# EAGLE design schematic hovedboks (EAGLE 9.6.2)
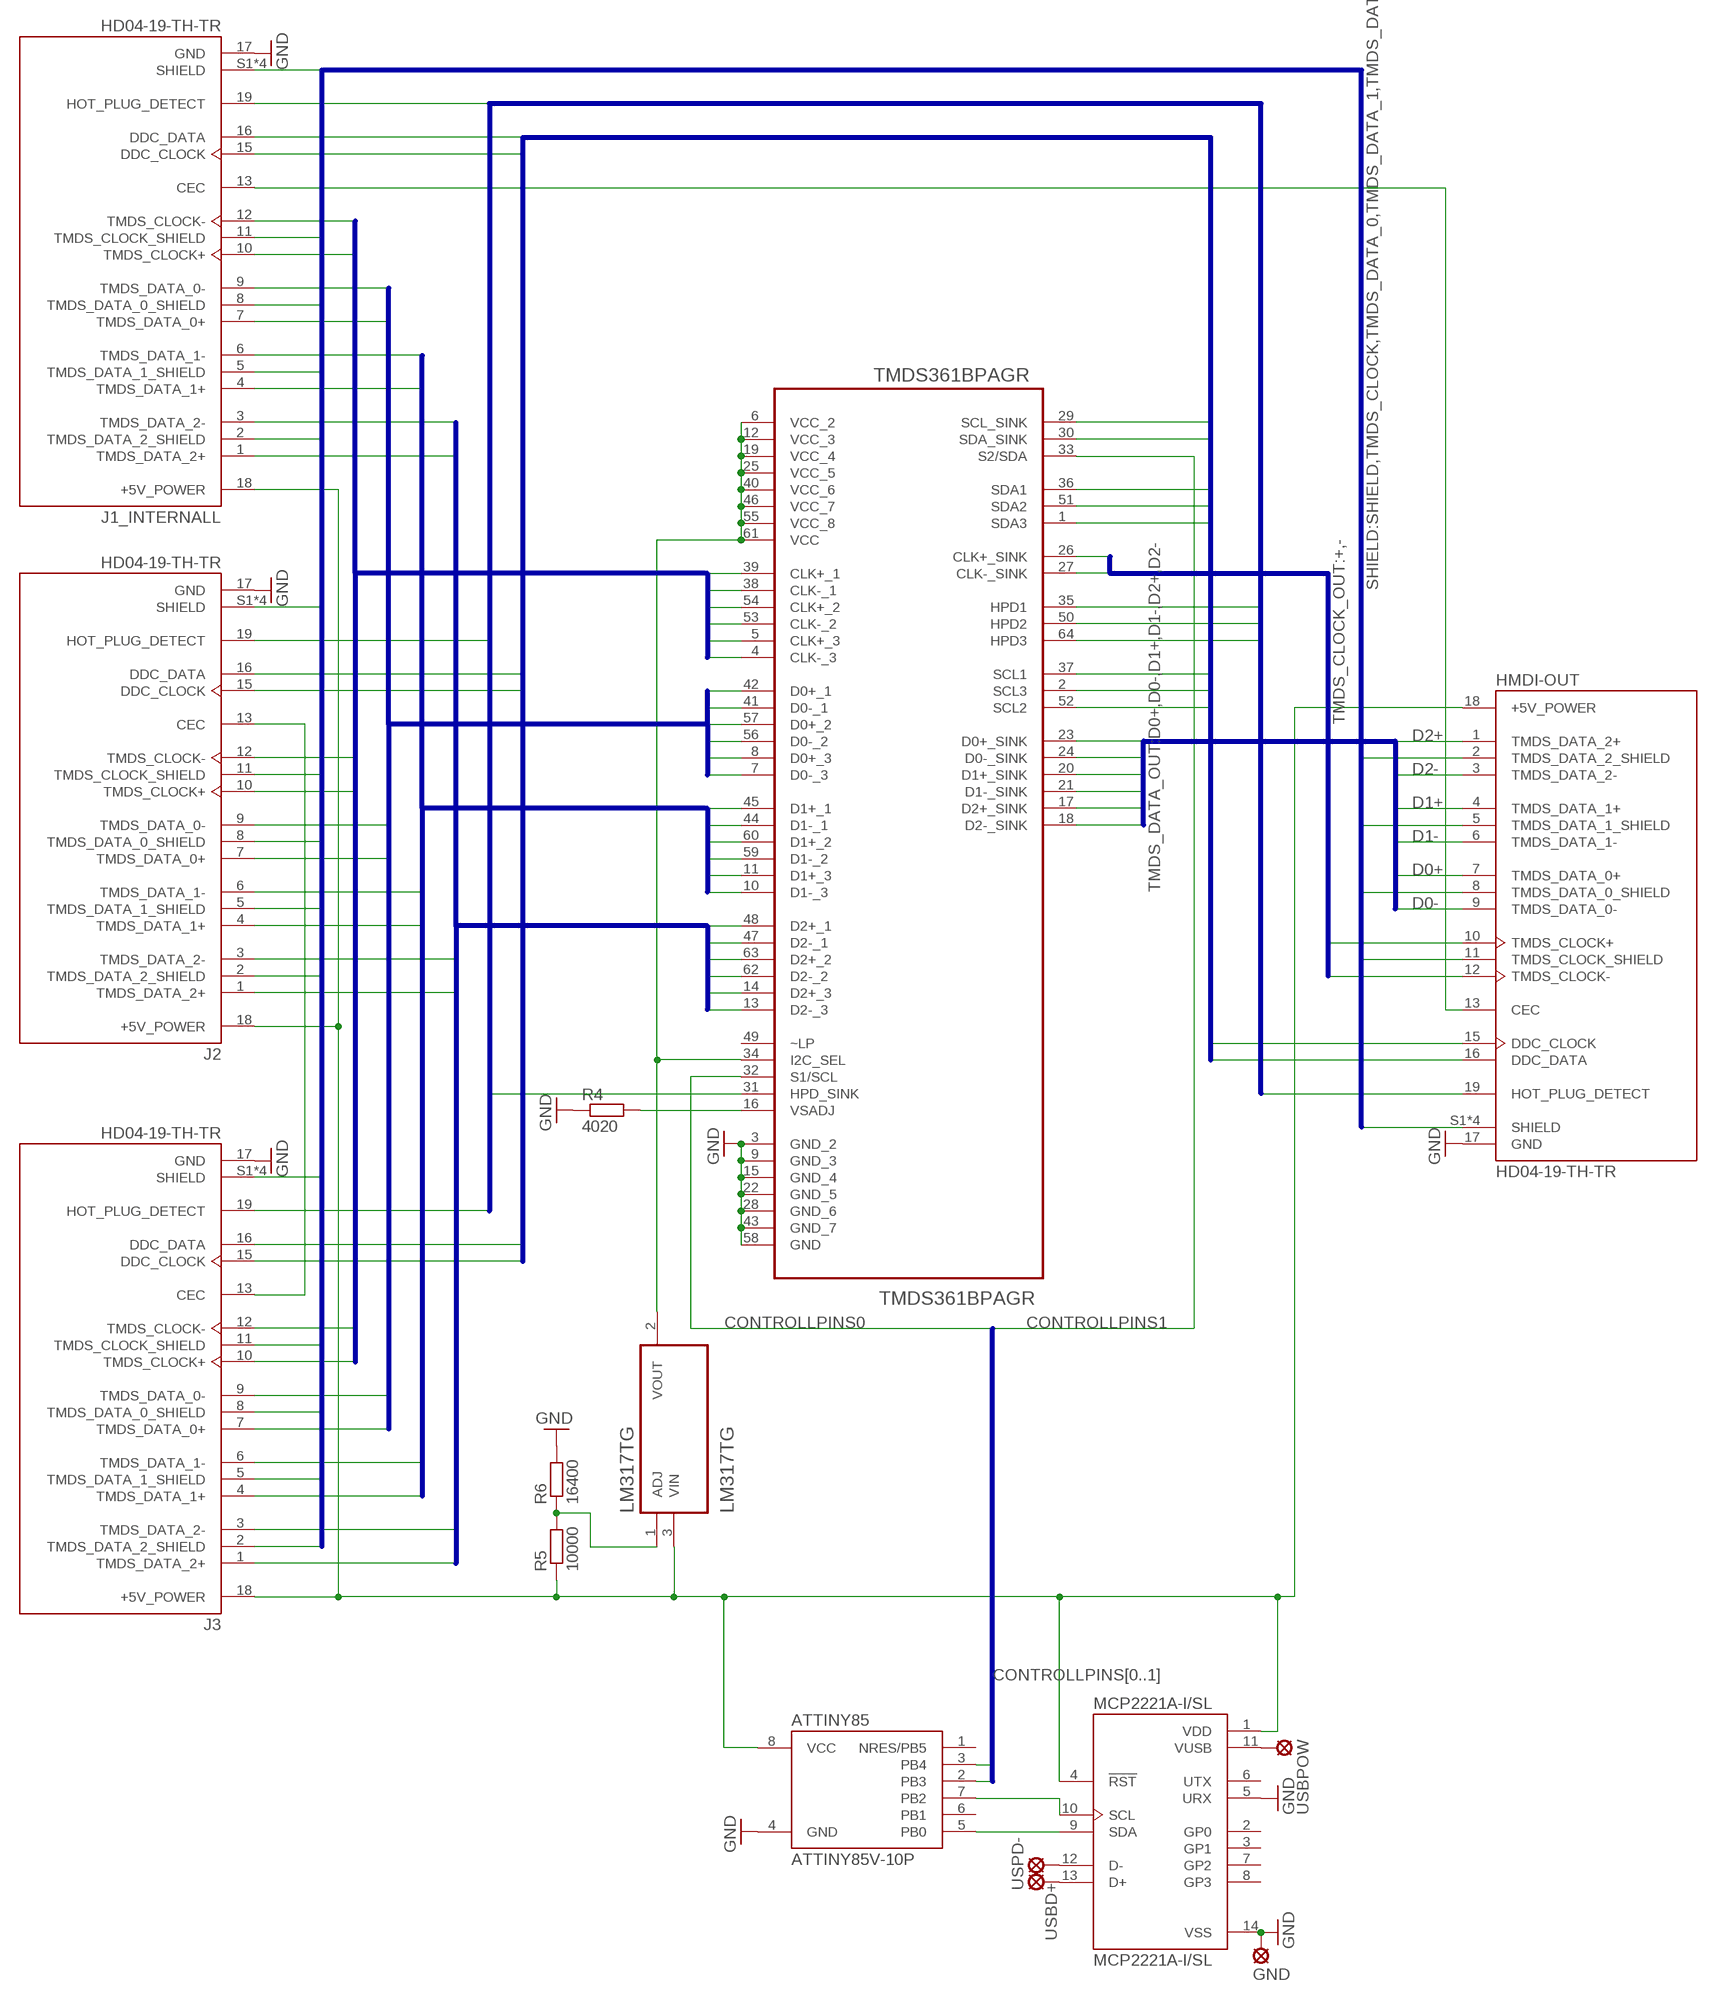
[diagram p0: schematic, sheet 1]

## Parts
ATTINY85  ATTINY85V-10P  [PDIP08_300MIL]
GND  LSP10  [LSP10]
HMDI-OUT  HD04-19-TH-TR  [CUI_HD04-19-TH-TR]
J1_INTERNALL  HD04-19-TH-TR  [CUI_HD04-19-TH-TR]
J2  HD04-19-TH-TR  [CUI_HD04-19-TH-TR]
J3  HD04-19-TH-TR  [CUI_HD04-19-TH-TR]
LM317TG  LM317TG  [TO254P1054X470X1955-3]
MCP2221A-I/SL  MCP2221A-I/SL  [SOIC127P600X175-14N]
R4  4020  R-EU_0204/7  [0204/7]
R5  10000  R-EU_0204/7  [0204/7]
R6  16400  R-EU_0204/7  [0204/7]
TMDS361BPAGR  TMDS361BPAGR  [QFP50P1200X1200X120-64N]
USBD+  LSP10  [LSP10]
USBPOW  LSP10  [LSP10]
USPD-  LSP10  [LSP10]

## Nets
1: J1_INTERNALL.19(HOT_PLUG_DETECT) TMDS361BPAGR.35(HPD1)
1_CLOCK: J1_INTERNALL.15(DDC_CLOCK) TMDS361BPAGR.37(SCL1)
1_DATA: J1_INTERNALL.16(DDC_DATA) TMDS361BPAGR.36(SDA1)
2: J2.19(HOT_PLUG_DETECT) TMDS361BPAGR.50(HPD2)
2_CLOCK: J2.15(DDC_CLOCK) TMDS361BPAGR.2(SCL3)
2_DATA: J2.16(DDC_DATA) TMDS361BPAGR.51(SDA2)
3: J3.19(HOT_PLUG_DETECT) TMDS361BPAGR.64(HPD3)
3_CLOCK: J3.15(DDC_CLOCK) TMDS361BPAGR.52(SCL2)
3_DATA: J3.16(DDC_DATA) TMDS361BPAGR.1(SDA3)
5V: ATTINY85.8(VCC) HMDI-OUT.18(+5V_POWER) J1_INTERNALL.18(+5V_POWER) J2.18(+5V_POWER) J3.18(+5V_POWER) LM317TG.3(VIN) MCP2221A-I/SL.1(VDD) MCP2221A-I/SL.4(!RST) R5.1
+: HMDI-OUT.10(TMDS_CLOCK+) TMDS361BPAGR.26(CLK+_SINK)
+1: J1_INTERNALL.1(TMDS_DATA_2+) J1_INTERNALL.4(TMDS_DATA_1+) J1_INTERNALL.7(TMDS_DATA_0+) J1_INTERNALL.10(TMDS_CLOCK+) J3.10(TMDS_CLOCK+) TMDS361BPAGR.39(CLK+_1) TMDS361BPAGR.42(D0+_1) TMDS361BPAGR.45(D1+_1) TMDS361BPAGR.48(D2+_1)
+2: J2.1(TMDS_DATA_2+) J2.4(TMDS_DATA_1+) J2.7(TMDS_DATA_0+) J2.10(TMDS_CLOCK+) TMDS361BPAGR.54(CLK+_2) TMDS361BPAGR.57(D0+_2) TMDS361BPAGR.60(D1+_2) TMDS361BPAGR.63(D2+_2)
+3: J3.1(TMDS_DATA_2+) J3.4(TMDS_DATA_1+) J3.7(TMDS_DATA_0+) TMDS361BPAGR.5(CLK+_3) TMDS361BPAGR.8(D0+_3) TMDS361BPAGR.11(D1+_3) TMDS361BPAGR.14(D2+_3)
-: HMDI-OUT.12(TMDS_CLOCK-) TMDS361BPAGR.27(CLK-_SINK)
-1: J1_INTERNALL.3(TMDS_DATA_2-) J1_INTERNALL.6(TMDS_DATA_1-) J1_INTERNALL.9(TMDS_DATA_0-) J1_INTERNALL.12(TMDS_CLOCK-) J3.12(TMDS_CLOCK-) TMDS361BPAGR.38(CLK-_1) TMDS361BPAGR.41(D0-_1) TMDS361BPAGR.44(D1-_1) TMDS361BPAGR.47(D2-_1)
-2: J2.3(TMDS_DATA_2-) J2.6(TMDS_DATA_1-) J2.9(TMDS_DATA_0-) J2.12(TMDS_CLOCK-) TMDS361BPAGR.53(CLK-_2) TMDS361BPAGR.56(D0-_2) TMDS361BPAGR.59(D1-_2) TMDS361BPAGR.62(D2-_2)
-3: J3.3(TMDS_DATA_2-) J3.6(TMDS_DATA_1-) J3.9(TMDS_DATA_0-) TMDS361BPAGR.4(CLK-_3) TMDS361BPAGR.7(D0-_3) TMDS361BPAGR.10(D1-_3) TMDS361BPAGR.13(D2-_3)
CEC_INTERNAL-OUT: HMDI-OUT.13(CEC) J1_INTERNALL.13(CEC)
CONTROLLPINS0: ATTINY85.2(PB3) TMDS361BPAGR.32(S1/SCL)
CONTROLLPINS1: ATTINY85.3(PB4) TMDS361BPAGR.33(S2/SDA)
D0+: HMDI-OUT.7(TMDS_DATA_0+) TMDS361BPAGR.23(D0+_SINK)
D0-: HMDI-OUT.9(TMDS_DATA_0-) TMDS361BPAGR.24(D0-_SINK)
D1+: HMDI-OUT.4(TMDS_DATA_1+) TMDS361BPAGR.20(D1+_SINK)
D1-: HMDI-OUT.6(TMDS_DATA_1-) TMDS361BPAGR.21(D1-_SINK)
D2+: HMDI-OUT.1(TMDS_DATA_2+) TMDS361BPAGR.17(D2+_SINK)
D2-: HMDI-OUT.3(TMDS_DATA_2-) TMDS361BPAGR.18(D2-_SINK)
GND: ATTINY85.4(GND) GND.MP HMDI-OUT.17(GND) J1_INTERNALL.17(GND) J2.17(GND) J3.17(GND) MCP2221A-I/SL.5(URX) MCP2221A-I/SL.14(VSS) R4.1 R6.2 TMDS361BPAGR.3(GND_2) TMDS361BPAGR.9(GND_3) TMDS361BPAGR.15(GND_4) TMDS361BPAGR.22(GND_5) TMDS361BPAGR.28(GND_6) TMDS361BPAGR.43(GND_7) TMDS361BPAGR.58(GND)
N$1: J2.13(CEC) J3.13(CEC)
N$3: LM317TG.2(VOUT) TMDS361BPAGR.6(VCC_2) TMDS361BPAGR.12(VCC_3) TMDS361BPAGR.19(VCC_4) TMDS361BPAGR.25(VCC_5) TMDS361BPAGR.34(I2C_SEL) TMDS361BPAGR.40(VCC_6) TMDS361BPAGR.46(VCC_7) TMDS361BPAGR.55(VCC_8) TMDS361BPAGR.61(VCC)
N$4: LM317TG.1(ADJ) R5.2 R6.1
N$5: ATTINY85.5(PB0) MCP2221A-I/SL.9(SDA)
N$6: ATTINY85.7(PB2) MCP2221A-I/SL.10(SCL)
N$7: MCP2221A-I/SL.11(VUSB) USBPOW.MP
N$8: MCP2221A-I/SL.13(D+) USBD+.MP
N$9: MCP2221A-I/SL.12(D-) USPD-.MP
N$10: R4.2 TMDS361BPAGR.16(VSADJ)
OUT: HMDI-OUT.19(HOT_PLUG_DETECT) TMDS361BPAGR.31(HPD_SINK)
OUT_CLOCK: HMDI-OUT.15(DDC_CLOCK) TMDS361BPAGR.29(SCL_SINK)
OUT_DATA: HMDI-OUT.16(DDC_DATA) TMDS361BPAGR.30(SDA_SINK)
SHIELD: HMDI-OUT.S1(SHIELD) HMDI-OUT.S2(SHIELD) HMDI-OUT.S3(SHIELD) HMDI-OUT.S4(SHIELD) J1_INTERNALL.S1(SHIELD) J1_INTERNALL.S2(SHIELD) J1_INTERNALL.S3(SHIELD) J1_INTERNALL.S4(SHIELD) J2.S1(SHIELD) J2.S2(SHIELD) J2.S3(SHIELD) J2.S4(SHIELD) J3.S1(SHIELD) J3.S2(SHIELD) J3.S3(SHIELD) J3.S4(SHIELD)
TMDS_CLOCK: HMDI-OUT.11(TMDS_CLOCK_SHIELD) J1_INTERNALL.11(TMDS_CLOCK_SHIELD) J2.11(TMDS_CLOCK_SHIELD) J3.11(TMDS_CLOCK_SHIELD)
TMDS_DATA_0: HMDI-OUT.8(TMDS_DATA_0_SHIELD) J1_INTERNALL.8(TMDS_DATA_0_SHIELD) J2.8(TMDS_DATA_0_SHIELD) J3.8(TMDS_DATA_0_SHIELD)
TMDS_DATA_1: HMDI-OUT.5(TMDS_DATA_1_SHIELD) J1_INTERNALL.5(TMDS_DATA_1_SHIELD) J2.5(TMDS_DATA_1_SHIELD) J3.5(TMDS_DATA_1_SHIELD)
TMDS_DATA_2: HMDI-OUT.2(TMDS_DATA_2_SHIELD) J1_INTERNALL.2(TMDS_DATA_2_SHIELD) J2.2(TMDS_DATA_2_SHIELD) J3.2(TMDS_DATA_2_SHIELD)
Unconnected: ATTINY85.1(NRES/PB5) ATTINY85.6(PB1) MCP2221A-I/SL.2(GP0) MCP2221A-I/SL.3(GP1) MCP2221A-I/SL.6(UTX) MCP2221A-I/SL.7(GP2) MCP2221A-I/SL.8(GP3) TMDS361BPAGR.49(~LP)

## Buses
TMDS_DATA_OUT:D0+,D0-,D1+,D1-,D2+,D2-
SHIELD:SHIELD,TMDS_CLOCK,TMDS_DATA_0,TMDS_DATA_1,TMDS_DATA_2
TMDS_CLOCK_OUT:+,-
TDMS_CLOCK_IN:+1,-1,+2,-2,+3,-3
TDMS_DATA_0_IN:+1,-1,+2,-2,+3,-3
TDMS_DATA_1_IN:+1,-1,+2,-2,+3,-3
TDMS_DATA_2_IN:+1,-1,+2,-2,+3,-3
HPD:1,2,3,OUT
DDC:1_CLOCK,1_DATA,2_CLOCK,2_DATA,3_CLOCK,3_DATA,OUT_CLOCK,OUT_DATA
CONTROLLPINS[0..1]

## Library data of the parts
ATTINY85 = _hhn_attiny25_45_85:ATTINY85*: ATMEL ATtiny 85 Packages: P = PDIP 08 30mil S = SOIC 08 EIAJ 208mil Technologies Note: for complete ordering code (temp. range, finish, tape&reel etc.) see www.atmel.com • Supply Voltage: V = (1.8…5.5)V | [blank] = (2.7…5.5)V • Speed: 10 = 10 MHz | 20 = 20 MHz Author: Dipl.-Ing. FH Rainer Bayer HHN Hochschule Heilbronn (Heilbronn University), rainer.bayer@hs-heilbronn.de Ingenieurbüro ing-rb, mail@ing-rb.de
GND USBD+ USBPOW USPD- = solpad:LSP10: SOLDER PAD drill 1.0 mm, distributor Buerklin, 12H555
HMDI-OUT J1_INTERNALL J2 J3 = HD04-19-TH-TR:HD04-19-TH-TR: HDMI RECEPTACLE; MANUFACTURER: CUI Devices; MAXIMUM_PACKAGE_HEIGHT: 6.27mm; PARTREV: 1.0; STANDARD: Manufacturer Recommendations
LM317TG = LM317TG:LM317TG: Check prices <https://pricing.snapeda.com/parts/LM317TG/ON%20Semiconductor/view-part?ref=eda>; AVAILABILITY: In Stock; DESCRIPTION: Linear Voltage Regulator IC Positive Adjustable 1 Output 1.5A TO-220-3; MF: ON Semiconductor; MP: LM317TG; PACKAGE: TO-220-3 ON Semiconductor; PRICE: None; PURCHASE-URL: https://pricing.snapeda.com/search/part/LM317TG/?ref=eda
MCP2221A-I/SL = MCP2221A-I_SL:MCP2221A-I/SL: USB 2.0-to-I2C/UART/SMBus Protocol Converter with GPIO (Master Mode) Check availability <https://pricing.snapeda.com/parts/MCP2221A-I/SL/Microchip/view-part?ref=eda>; AVAILABILITY: In Stock; DESCRIPTION: USB Bridge, USB to I²C/UART USB 2.0 I²C, UART Interface 14-SOIC; MF: Microchip; MP: MCP2221A-I/SL; PACKAGE: SO-14 Microchip; PRICE: None; PURCHASE-URL: https://pricing.snapeda.com/search/part/MCP2221A-I/SL/?ref=eda
R4-R6 = rcl:R-EU_: RESISTOR, European symbol; SPICEPREFIX: R
TMDS361BPAGR = Texas Instruments_By_element14_Batch_1:TMDS361BPAGR: Three-Port HDMI Switch; MPN: TMDS361BPAGR; OC_FARNELL: -; OC_NEWARK: 55R7479; PACKAGE: TQFP-64; SUPPLIER: Texas Instruments

## Board
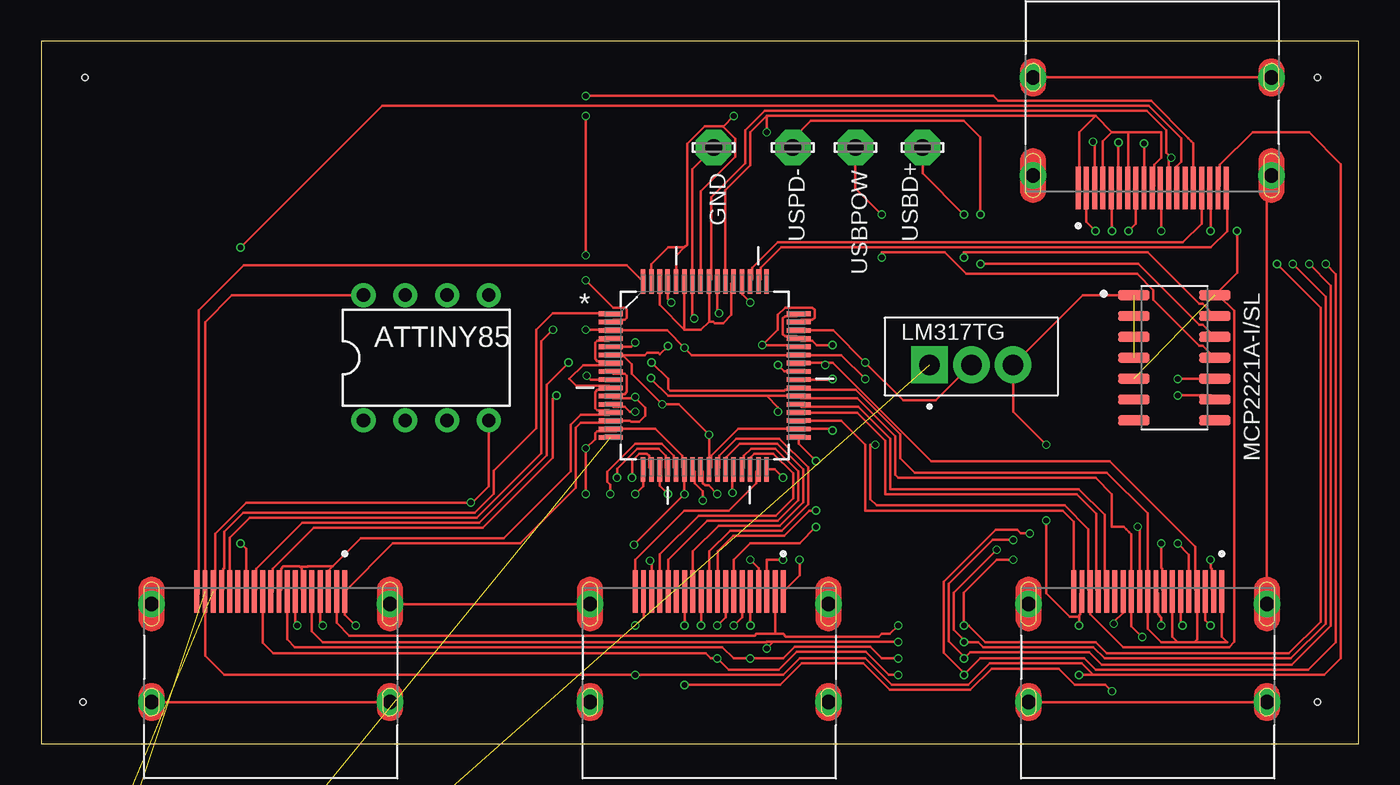
[diagram p1: board, top side]
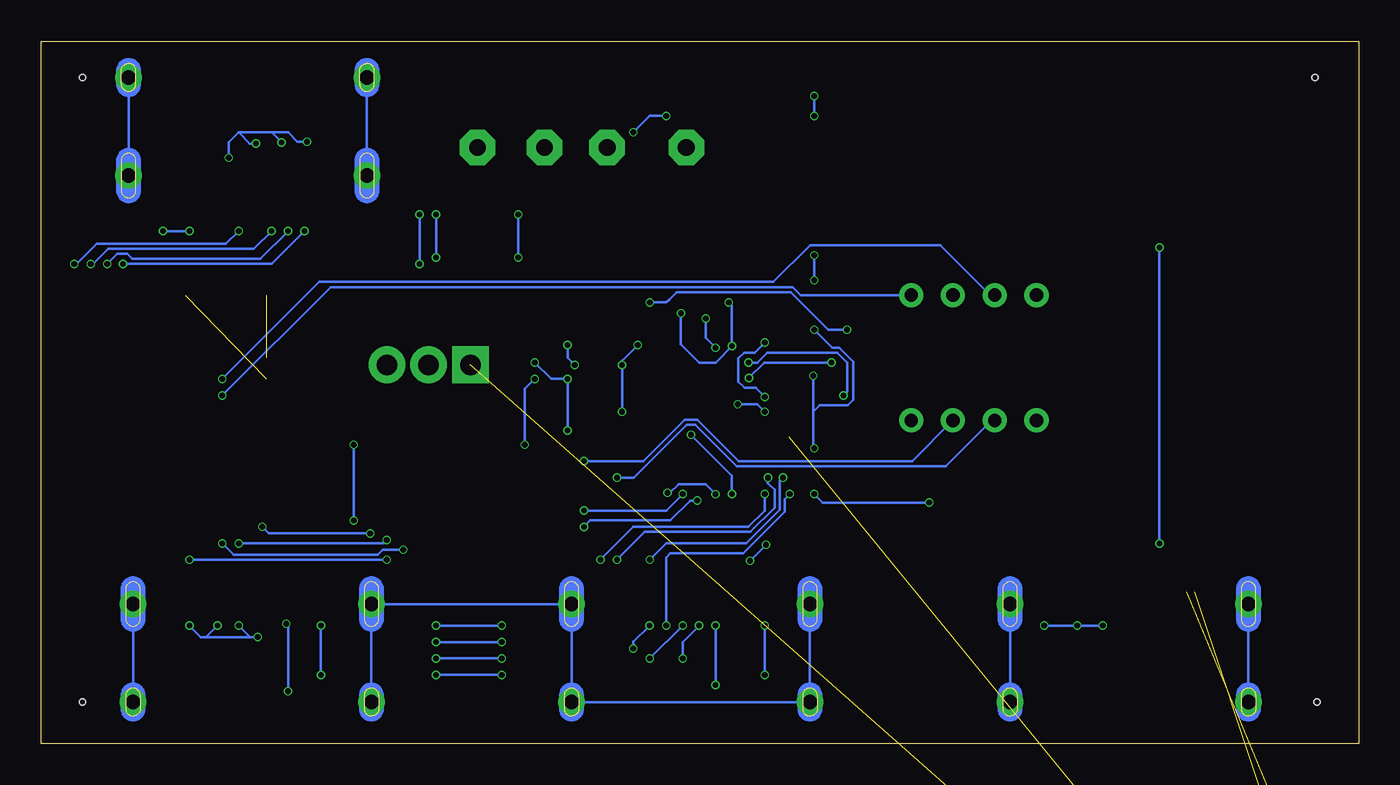
[diagram p2: board, bottom side, seen from below]

Size 80.15 x 42.74 mm. Coordinates in mm from the lower left corner, seen from the top.
Outline: 0,0 80.15,0 80.15,42.74 0,42.74 0,0
Copper layers (1*16): Top 0.035mm / dielectric 1.6mm / Bottom 0.035mm
Design rules "jlcpcb-2layers": minimum track width 5mil, minimum drill 0.3mm, track to track 5mil, track to pad 5mil, pad to pad 5mil, via to via 5mil, smd to smd 5mil, copper to edge 0.2mm, drill to drill 6mil, minimum pad ring 10mil, minimum via ring 3mil, stop-mask expansion 4mil, vias tented up to drill 0mil, thermal gap 10mil
Holes 0.35 mm at 2.67,40.53 2.54,2.54 77.63,40.53 77.63,2.54

### Footprints (pad centres in the part's own frame; a part is rotated, then mirrored left to right if it is on the bottom)
PDIP08_300MIL = drill 0.813: 1 -3.81,-3.81; 2 -1.27,-3.81; 3 1.27,-3.81; 4 3.81,-3.81; 5 3.81,3.81; 6 1.27,3.81; 7 -1.27,3.81; 8 -3.81,3.81
LSP10 = drill 1.016 pad 2.159 octagon: MP 0,0
CUI_HD04-19-TH-TR = smd 0.3 x 2.6: 1 4.5,6.72; 2 4,6.72; 3 3.5,6.72; 4 3,6.72; 5 2.5,6.72; 6 2,6.72; 7 1.5,6.72; 8 1,6.72; 9 0.5,6.72; 10 0,6.72; 11 -0.5,6.72; 12 -1,6.72; 13 -1.5,6.72; 14 -2,6.72; 15 -2.5,6.72; 16 -3,6.72; 17 -3.5,6.72; 18 -4,6.72; 19 -4.5,6.72 | drill 0.9 pad 1.5: S1 -7.25,5.96; S2 7.25,5.96; S3 -7.25,0; S4 7.25,0
TO254P1054X470X1955-3 = drill 1.24 square: 1 -2.54,0 | drill 1.24: 2 0,0; 3 2.54,0
SOIC127P600X175-14N = smd 1.91 x 0.6: 1 -2.46,3.81; 2 -2.46,2.54; 3 -2.46,1.27; 4 -2.46,0; 5 -2.46,-1.27; 6 -2.46,-2.54; 7 -2.46,-3.81; 8 2.46,-3.81; 9 2.46,-2.54; 10 2.46,-1.27; 11 2.46,0; 12 2.46,1.27; 13 2.46,2.54; 14 2.46,3.81
0204/7 = drill 0.813 octagon: 1 -3.81,0; 2 3.81,0
QFP50P1200X1200X120-64N = smd 1.473 x 0.279: 1 -5.715,3.759; 2 -5.715,3.251; 3 -5.715,2.743; 4 -5.715,2.261; 5 -5.715,1.753; 6 -5.715,1.245; 7 -5.715,0.762; 8 -5.715,0.254; 9 -5.715,-0.254; 10 -5.715,-0.762; 11 -5.715,-1.245; 12 -5.715,-1.753; 13 -5.715,-2.261; 14 -5.715,-2.743; 15 -5.715,-3.251; 16 -5.715,-3.759; 33 5.715,-3.759; 34 5.715,-3.251; 35 5.715,-2.743; 36 5.715,-2.261; 37 5.715,-1.753; 38 5.715,-1.245; 39 5.715,-0.762; 40 5.715,-0.254; 41 5.715,0.254; 42 5.715,0.762; 43 5.715,1.245; 44 5.715,1.753; 45 5.715,2.261; 46 5.715,2.743; 47 5.715,3.251; 48 5.715,3.759 | smd 0.279 x 1.473: 17 -3.759,-5.715; 18 -3.251,-5.715; 19 -2.743,-5.715; 20 -2.261,-5.715; 21 -1.753,-5.715; 22 -1.245,-5.715; 23 -0.762,-5.715; 24 -0.254,-5.715; 25 0.254,-5.715; 26 0.762,-5.715; 27 1.245,-5.715; 28 1.753,-5.715; 29 2.261,-5.715; 30 2.743,-5.715; 31 3.251,-5.715; 32 3.759,-5.715; 49 3.759,5.715; 50 3.251,5.715; 51 2.743,5.715; 52 2.261,5.715; 53 1.753,5.715; 54 1.245,5.715; 55 0.762,5.715; 56 0.254,5.715; 57 -0.254,5.715; 58 -0.762,5.715; 59 -1.245,5.715; 60 -1.753,5.715; 61 -2.261,5.715; 62 -2.743,5.715; 63 -3.251,5.715; 64 -3.759,5.715

### Placement (x,y rotation side)
ATTINY85  23.42,23.48 0 top
GND  40.91,36.26 0 top
HMDI-OUT  40.64,2.54 0 top
J1_INTERNALL  67.31,2.54 0 top
J2  67.58,40.53 180 top
J3  13.97,2.54 0 top
LM317TG  56.58,23.05 0 top
MCP2221A-I/SL  68.93,23.48 0 top
R4  5.13,-12.81 0 top  (outside the outline)
R5  5.13,-16.81 0 top  (outside the outline)
R6  5.13,-20.81 0 top  (outside the outline)
TMDS361BPAGR  40.37,22.4 0 top
USBD+  53.61,36.26 0 top
USBPOW  49.53,36.26 0 top
USPD-  45.72,36.26 0 top

### Tracks (layer width: path | path; a pad name or v marks a point on that pad's centre or on a via)
1
  Top 0.152: J1_INTERNALL.19 62.81,13.51 62.13,14.19 50.13,14.19 50.13,18.19 48.66,19.66 TMDS361BPAGR.35
1_CLOCK
  Top 0.152: J1_INTERNALL.15 64.69,9.38 64.69,13.92 63.12,15.49 51.65,15.49 51.65,18.57 49.71,20.51 46.22,20.51 TMDS361BPAGR.37
1_DATA
  Top 0.152: J1_INTERNALL.16 64.19,9.38 64.19,13.99 62.99,15.19 51.34,15.19 51.34,18.44 49.65,20.14 TMDS361BPAGR.36
2
  Top 0.152: TMDS361BPAGR.50 43.76,28.25 43.76,28.95 45,30.19 71.13,30.19 72.13,31.19 72.13,33.76 J2.19
2_CLOCK  (via drill 0.35)
  Top 0.152: v33.13,38.19 v33.13,29.72 | TMDS361BPAGR.2 34.8,25.79 35.49,25.79 35.62,25.93 35.62,26.39 35.49,26.53 34.79,26.53 v33.13,28.19 | v33.13,39.41 57.91,39.41 58.22,39.1 67.51,39.1 69.78,36.84 69.96,36.66 70.08,36.53 J2.15
  Bottom 0.152: v33.13,39.41 v33.13,38.19 | v33.13,29.72 v33.13,28.19
2_DATA
  Top 0.152: TMDS361BPAGR.51 43.25,28.25 43.25,28.95 44.8,30.5 69.44,30.5 70.58,31.64 J2.16
3
  Top 0.152: J3.19 9.59,9.14 9.59,26.37 12.34,29.11 35.61,29.11 TMDS361BPAGR.64
3_CLOCK  (via drill 0.35)
  Top 0.152: J3.15 11.47,12.53 12.7,13.76 26.51,13.76 30.43,17.69 30.43,24.5 v31.13,25.19 | v43.13,26.85 42.63,27.35 TMDS361BPAGR.52
  Bottom 0.152: v31.13,25.19 32.27,25.19 34.56,27.48 41.48,27.48 41.95,27.01 42.11,26.85 v43.13,26.85
3_DATA
  Top 0.152: J3.16 11.09,9.38 11.09,10.65 11.13,10.69 11.13,12.9 12.3,14.06 26.38,14.06 27.54,15.22 27.54,16.6 30.13,19.19 30.13,25.19 31.13,26.19 34.62,26.19 TMDS361BPAGR.1
5V  (via drill 0.35)  (2 unrouted)
  Top 0.152: ATTINY85.8 11.61,27.29 9.97,25.65 J3.18 9.97,5.35 11.13,4.19 v36.13,4.19 45.13,4.19 46.13,5.19 50.13,5.19 51.74,3.58 56.38,3.58 57.68,4.88 63.31,4.88 64,4.19 | 63.13,7.81 63.05,7.73 62.56,7.73 61.13,9.17 v61.13,13.58 | v61.13,18.19 59.12,20.2 LM317TG.3 63.36,27.29 MCP2221A-I/SL.1 | J2.18 71.7,33.93 71.7,35.2 73.69,37.19 77.13,37.19 79.06,35.26 79.06,5.19 78.06,4.19 64,4.19 | 64,4.19 v63.13,4.19 | J1_INTERNALL.18 63.19,9.14 63.19,7.87 63.13,7.81 | 63.13,7.81 v63.13,7.19 | HMDI-OUT.18 36.64,7.7 v36.13,7.19
  Bottom 0.152: v63.13,7.19 v63.13,4.19 | v36.13,7.19 v36.13,4.19 | v61.13,18.19 v61.13,13.58
+
  Top 0.152: TMDS361BPAGR.26 41.25,16.8 41.25,17.52 42.3,18.57 44.91,18.57 46.65,16.82 46.65,14.56 45.06,12.97 41.91,12.97 40.64,11.7 HMDI-OUT.10
+1  (via drill 0.35)
  Top 0.152: 69.13,6.19 68.13,6.19 67.31,7.01 J1_INTERNALL.10 67.31,14.01 64.83,16.5 53.13,16.5 52.26,17.37 52.26,18.82 49.55,21.52 46.2,21.52 | 69.13,6.19 70.13,6.19 | 70.13,6.19 72.13,6.19 71.81,6.51 J1_INTERNALL.1 | J1_INTERNALL.7 68.81,6.51 69.13,6.19 | 70.13,6.19 70.31,6.37 J1_INTERNALL.4 70.19,9.38 70.19,11.99 64.99,17.19 54.13,17.19 48.16,23.16 47.82,23.16 | 46.2,21.52 TMDS361BPAGR.39 | 47.82,23.16 TMDS361BPAGR.42 | J3.10 14.09,9.26 14.09,10.65 16.59,13.15 26.87,13.15 31.13,17.41 31.13,20.97 v31.35,21.19 | v37.13,23.19 38.13,22.19 38.13,21.59 38.26,21.46 45.19,21.46 45.25,21.52 46.2,21.52 | TMDS361BPAGR.48 45.95,26.02 45.25,26.02 45.12,25.89 45.12,24.91 45.25,24.78 45.97,24.78 TMDS361BPAGR.45 46.22,24.52 46.92,24.52 47.19,24.25 v48.13,24.25 | 47.82,23.16 v47.69,23.04
  Bottom 0.152: v37.13,23.19 36.6,23.19 35.99,23.8 31.74,23.8 31.13,23.19 31.13,21.41 v31.35,21.19 | v47.69,23.04 48.13,23.48 v48.13,24.25
+2  (via drill 0.35)
  Top 0.152: J2.1 63.13,33.86 63.13,37.19 64.13,38.19 | 66.13,37.19 68.13,37.19 68.13,35.63 67.7,35.2 67.7,33.93 J2.10 | 65.13,37.19 66.13,37.19 | J2.4 64.58,36.64 65.13,37.19 | J2.7 66.13,33.86 66.13,37.19 | TMDS361BPAGR.54 41.61,33.67 43.13,35.19 43.13,37.19 44.13,38.19 | 64.13,38.19 65.13,37.19 | 44.13,38.19 64.13,38.19 | TMDS361BPAGR.63 37.12,29.18 38.13,30.19 39.13,30.19 | TMDS361BPAGR.60 38.62,29.68 39.13,30.19 | 41.48,37.54 42.22,36.8 42.22,35.72 40.12,33.62 TMDS361BPAGR.57 | 41.48,37.54 41.45,37.57 40.37,37.57 39.3,36.5 39.3,30.36 39.13,30.19 | 41.48,37.54 v42.13,38.19 | v44.13,37.19 44.13,38.19
  Bottom 0.152: v42.13,38.19 43.13,38.19 v44.13,37.19
+3  (via drill 0.35)
  Top 0.152: v19.13,7.19 18.47,7.85 J3.1 21.4,12.19 29.13,12.19 32.52,15.58 32.52,19.22 32.82,19.52 34.52,19.52 TMDS361BPAGR.14 35.8,19.66 35.88,19.58 36.38,19.58 36.74,19.94 36.74,20.44 36.16,21.02 36.13,21.02 | v15.58,7.19 15.47,7.3 J3.7 | 36.13,21.02 34.8,21.02 TMDS361BPAGR.11 34.77,21.27 35.49,21.27 35.62,21.4 35.62,22.38 35.49,22.51 34.8,22.51 TMDS361BPAGR.8 | 36.13,21.02 v36.13,21.1 | v36.13,24.4 35.88,24.15 TMDS361BPAGR.5 | v17.13,7.19 16.97,7.35 J3.4
  Bottom 0.152: v19.13,7.19 v17.13,7.19 v15.58,7.19 | v36.13,24.4 36.74,23.8 37.38,23.8 37.74,23.44 37.74,22.03 37.35,21.65 36.68,21.65 v36.13,21.1
-
  Top 0.152: TMDS361BPAGR.27 41.68,16.75 41.68,17.44 42.5,18.26 44.78,18.26 46.35,16.69 46.35,14.69 44.94,13.28 41.22,13.28 39.64,11.7 HMDI-OUT.12
-1  (via drill 0.35)
  Top 0.152: v66.97,6.49 66.31,7.15 66.31,9.19 J1_INTERNALL.12 66.31,12.73 66.19,12.86 65.99,13.05 65.85,13.19 65.13,13.19 65.13,15.19 64.13,16.19 52.13,16.19 51.95,16.37 51.95,18.69 49.63,21.02 46.22,21.02 TMDS361BPAGR.38 44.13,21.16 | v71.13,7.19 70.81,7.51 J1_INTERNALL.3 | J1_INTERNALL.9 67.93,9.14 67.93,7.87 68.13,7.67 v68.13,7.19 | J1_INTERNALL.6 69.31,7.3 v69.42,7.19 | J3.12 13.09,9.38 13.09,10.65 15.89,13.45 26.63,13.45 30.74,17.56 30.74,21.85 v32.08,23.19 | 44.13,21.16 38.13,21.16 37.1,22.18 v37.1,22.25 | TMDS361BPAGR.41 45.2,22.65 v44.82,23.04 | TMDS361BPAGR.44 45.99,24.25 v43.87,24.25 44.81,25.2 44.81,26.09 45.25,26.53 46.92,26.53 47.05,26.39 47.05,25.93 46.92,25.79 46.22,25.79 TMDS361BPAGR.47 | v44.82,20.19 44.82,20.47 44.13,21.16
  Bottom 0.152: 67.43,6.49 70.13,6.49 | 70.13,6.49 70.43,6.49 v71.13,7.19 | v68.13,7.19 67.43,6.49 | 67.43,6.49 v66.97,6.49 | v69.42,7.19 69.43,7.19 70.13,6.49 | v37.1,22.25 36.17,23.19 v32.08,23.19 | v43.87,24.25 44.82,23.3 v44.82,23.04 v44.82,20.19
-2  (via drill 0.35)
  Top 0.152: J2.3 64.08,36.62 v63.97,36.62 | J2.9 v67.08,36.51 | J2.6 65.52,33.87 v65.52,36.57 | J2.12 68.58,35.48 v68.74,35.64 68.44,35.94 68.44,37.32 67.26,38.49 44,38.49 42.83,37.32 42.83,35.32 40.76,33.25 40.76,28.25 TMDS361BPAGR.56 40.62,25.68 | 39.13,25.19 40.13,25.19 40.62,25.68 | TMDS361BPAGR.53 41.98,27.98 41.98,26.08 41.48,25.58 40.98,25.58 40.88,25.68 40.62,25.68 | 39.13,25.19 37.63,26.69 TMDS361BPAGR.62 | 39.13,25.19 39.13,25.62 39.12,25.62 TMDS361BPAGR.59
  Bottom 0.152: v63.97,36.62 64.56,36.62 65.13,37.19 66.13,37.19 | 68.13,37.19 66.13,37.19 | v67.08,36.51 67.45,36.51 68.13,37.19 | v65.52,36.57 65.52,36.58 66.13,37.19 | v68.74,35.64 68.74,36.58 68.13,37.19
-3
  Top 0.152: 15.72,10.78 15.85,10.65 15.85,9.38 J3.6 | 15.72,10.78 15.71,10.79 14.72,10.79 14.59,10.65 14.59,9.38 J3.9 | 17.72,10.79 16.22,10.79 16.22,10.78 15.72,10.78 | 17.72,10.79 19.43,12.49 28.13,12.49 32.22,16.58 32.22,19.42 32.82,20.03 34.54,20.03 TMDS361BPAGR.13 34.52,20.28 33.82,20.28 33.69,20.41 33.69,21.39 33.82,21.52 34.54,21.52 TMDS361BPAGR.10 34.52,21.78 32.54,21.78 32.13,22.19 32.96,23.02 34.52,23.02 TMDS361BPAGR.7 34.54,23.28 33.82,23.28 33.69,23.41 33.69,24.39 33.82,24.52 34.52,24.52 TMDS361BPAGR.4 | J3.3 17.47,10.53 17.72,10.79
CEC_INTERNAL-OUT  (via drill 0.35)
  Top 0.152: HMDI-OUT.13 v39.14,7.2 v39.13,7.19 | v39.13,3.58 44.95,3.58 46.26,4.88 50,4.88 51.61,3.28 56.51,3.28 57.81,4.58 61.88,4.58 62.88,3.58 64.74,3.58 v65.13,3.19 | v65.25,7.31 65.25,7.42 65.81,7.99 J1_INTERNALL.13
  Bottom 0.152: v39.13,7.19 v39.13,3.58 | v65.13,3.19 65.13,7.19 v65.25,7.31
CONTROLLPINS0  (via drill 0.35)
  Top 0.152: TMDS361BPAGR.32 44.63,16.69 v45.13,16.19
  Bottom 0.152: v45.13,16.19 44.1,16.19 40.88,19.41 40.37,19.41 37.85,16.89 25.13,16.89 22.34,19.67 ATTINY85.2
CONTROLLPINS1  (via drill 0.35)
  Top 0.152: v47.13,17.2 46.08,18.24 TMDS361BPAGR.33
  Bottom 0.152: ATTINY85.3 27.17,17.19 37.72,17.19 40.25,19.71 41,19.71 43.52,17.2 v47.13,17.2
D0+  (via drill 0.35)
  Top 0.152: TMDS361BPAGR.23 39.75,16.55 39.75,15.85 40.24,15.36 v40.24,14.8 | v47.13,13.19 46.13,12.19 43.13,12.19 42.14,11.2 HMDI-OUT.7
  Bottom 0.152: v40.24,14.8 40.66,14.8 41.88,13.58 46.74,13.58 v47.13,13.19
D0-  (via drill 0.35)
  Top 0.152: TMDS361BPAGR.24 40.26,16.55 40.26,15.85 40.39,15.72 40.6,15.72 v41.13,15.19 | v47.13,14.19 46.71,14.19 45.19,12.67 42.1,12.67 41.14,11.7 HMDI-OUT.9
  Bottom 0.152: v41.13,15.19 42.13,14.19 v47.13,14.19
D1+  (via drill 0.35)
  Top 0.152: TMDS361BPAGR.20 37.99,16.8 37.99,17.52 37.56,17.96 36.25,17.96 35.03,16.74 v35.03,16.19 | HMDI-OUT.4 43.64,10.68 v43.13,11.19
  Bottom 0.152: v35.03,16.19 35.22,16 35.22,14.24 37.27,12.19 42.13,12.19 v43.13,11.19
D1-  (via drill 0.35)
  Top 0.152: TMDS361BPAGR.21 38.48,16.83 38.48,17.19 38.48,17.52 37.73,18.26 36.12,18.26 34.42,16.56 34.42,15.94 34.61,15.75 v34.61,15.19 | HMDI-OUT.6 42.64,7.7 v42.13,7.19
  Bottom 0.152: v34.61,15.19 34.91,14.89 34.91,14.11 37.44,11.58 41.88,11.58 42.13,11.33 v42.13,7.19
D2+  (via drill 0.35)
  Top 0.152: v46.13,11.19 46.13,10.25 HMDI-OUT.1 | TMDS361BPAGR.17 36.61,15.67 v36.13,15.19
  Bottom 0.152: v36.13,15.19 36.13,14.19 37.13,13.19 44.13,13.19 v46.13,11.19
D2-  (via drill 0.35)
  Top 0.152: TMDS361BPAGR.18 36.98,16.83 36.98,17.52 36.84,17.65 36.38,17.65 35.94,17.21 v35.94,16.19 | v45.13,11.19 44.14,11.19 HMDI-OUT.3
  Bottom 0.152: v35.94,16.19 35.94,15.86 35.52,15.44 35.52,14.37 37,12.88 43.44,12.88 v45.13,11.19
GND  (via drill 0.35)  (3 unrouted)
  Top 0.152: J3.17 10.59,9.38 10.59,12.79 12.47,14.67 v26.13,14.67 26.23,14.67 27.23,15.67 ATTINY85.4 | GND.MP 39.61,34.96 TMDS361BPAGR.58 39.61,26 v39.73,25.87 | v50.74,18.19 50.44,18.19 50.44,14.88 50.83,14.49 62.26,14.49 63.69,13.06 63.69,9.38 J1_INTERNALL.17 63.81,7.88 65.81,5.88 72.26,5.88 72.57,6.2 72.57,26.33 71.61,27.29 MCP2221A-I/SL.14 72.74,28.64 v72.74,31.19 | v50.13,22.19 48.67,23.64 TMDS361BPAGR.43 39.57,23.64 v39.13,24.08 38.07,25.14 TMDS361BPAGR.3 34.61,25.19 v33.13,25.19 | v37.03,11.13 37.14,11.03 HMDI-OUT.17 | v36.05,12.11 v39.12,15.19 TMDS361BPAGR.22 38.99,16.83 38.99,17.52 37.35,19.15 35.13,19.15 | v42.05,15.28 42.05,16.61 TMDS361BPAGR.28 | 35.13,19.15 TMDS361BPAGR.15 34.52,19.01 | 34.52,19.01 34.99,19.01 35.13,19.15 | v33.13,15.19 v33.13,17.97 33.69,18.53 33.69,18.88 33.82,19.01 34.52,19.01 | TMDS361BPAGR.9 33.42,22.15 v33.18,22.39 | J2.17 71.13,33.76 v71.13,31.19
  Bottom 0.152: v50.74,18.19 50.74,21.58 v50.13,22.19 | v72.74,31.19 v71.13,31.19 | v36.05,12.11 v37.03,11.13 | v42.05,15.28 41.9,15.28 41.38,15.8 39.74,15.8 v39.12,15.19 | v26.13,14.67 32.61,14.67 v33.13,15.19 | v33.18,22.39 33.18,20.19 | 33.18,20.19 33.18,18.02 v33.13,17.97 | v33.13,25.19 32.04,24.1 31.61,24.1 30.74,23.23 30.74,20.94 31.09,20.58 32.79,20.58 33.18,20.19 | v39.13,24.08 39.73,24.69 v39.73,25.87
N$1  (via drill 0.35)
  Top 0.152: J3.13 12.47,11.85 v12.13,12.19 | J2.13 69.08,35.13 69.34,35.39 69.34,36.84 67.38,38.8 20.74,38.8 v12.13,30.19
  Bottom 0.152: v12.13,12.19 v12.13,30.19
N$3  (via drill 0.35)
  Top 0.152: TMDS361BPAGR.61 38.11,27.07 v38.33,26.85 | v38.13,15.19 37.63,15.69 TMDS361BPAGR.19 | TMDS361BPAGR.12 34.8,20.51 35.49,20.51 35.8,20.19 v36.13,20.19 | v48.13,22.19 48.09,22.15 TMDS361BPAGR.40 | v38.13,24.19 37.63,23.69 37.52,23.8 36.88,23.8 36.73,23.64 TMDS361BPAGR.6 35.37,23.64 35.92,23.09 35.92,22.5 v37.78,20.65 38.78,20.65 v40.62,18.8 TMDS361BPAGR.25 40.76,16.83 40.76,17.52 42.4,19.15 TMDS361BPAGR.34 48.03,19.15 v48.13,19.05 | TMDS361BPAGR.46 48.18,25.14 v50.13,23.19 52.43,20.89 54.42,20.89 LM317TG.2 | TMDS361BPAGR.55 41.13,26.29 v41.23,26.19
  Bottom 0.152: v40.62,18.8 38.13,16.31 v38.13,15.19 | v37.78,20.65 36.59,20.65 v36.13,20.19 | v38.33,26.85 38.13,26.65 v38.13,24.19 39.13,23.19 40.13,23.19 41.23,24.29 v41.23,26.19 | v50.13,23.19 49.13,22.19 v48.13,22.19 v48.13,19.05
N$4  (2 unrouted)
N$5  (via drill 0.35)
  Top 0.152: v69.13,21.19 71.14,21.19 MCP2221A-I/SL.9
  Bottom 0.152: ATTINY85.5 33.94,27.29 34.44,27.78 62.54,27.78 v69.13,21.19
N$6  (via drill 0.35)
  Top 0.152: v69.13,22.19 71.37,22.19 MCP2221A-I/SL.10
  Bottom 0.152: ATTINY85.7 22.43,27.29 25.47,30.33 33.38,30.33 35.62,28.09 63.23,28.09 v69.13,22.19
N$7  (via drill 0.35)
  Top 0.152: MCP2221A-I/SL.11 70.65,24.22 70.43,24.22 67.65,27 67.65,27.6 66.67,28.58 56.27,28.58 54.97,29.89 51.13,29.89 v51.13,29.58 | v51.13,32.19 49.53,33.79 USBPOW.MP
  Bottom 0.152: v51.13,29.58 v51.13,32.19
N$8  (via drill 0.35)
  Top 0.152: MCP2221A-I/SL.13 70.65,26.76 70.43,26.76 67.3,29.89 56.13,29.89 v56.13,29.58 | v56.13,32.19 53.61,34.71 USBD+.MP
  Bottom 0.152: v56.13,29.58 v56.13,32.19
N$9  (via drill 0.35)
  Top 0.152: MCP2221A-I/SL.12 70.65,25.49 70.43,25.49 66.73,29.19 v57.13,29.19 | v57.13,32.19 57.13,36.88 56.13,37.88 46.83,37.88 45.72,36.78 USPD-.MP
  Bottom 0.152: v57.13,29.19 v57.13,32.19
N$10  (1 unrouted)
OUT
  Top 0.152: TMDS361BPAGR.31 43.48,16.55 43.48,15.85 41.82,14.19 39.13,14.19 36.14,11.2 HMDI-OUT.19
OUT_CLOCK
  Top 0.152: TMDS361BPAGR.29 42.74,16.8 42.74,17.52 43.18,17.96 44.65,17.96 46.04,16.57 46.04,14.81 44.81,13.58 40.52,13.58 38.14,11.2 HMDI-OUT.15
OUT_DATA
  Top 0.152: TMDS361BPAGR.30 43.18,16.75 43.18,17.44 43.39,17.65 44.53,17.65 45.74,16.44 45.74,14.94 44.68,13.88 39.99,13.88 37.64,11.53 HMDI-OUT.16
SHIELD
  Top 0.152: J1_INTERNALL.S2 74.56,34.3 J2.S1 | J1_INTERNALL.S4 J1_INTERNALL.S3 | HMDI-OUT.S1 J3.S2 | J3.S4 J3.S3 | J2.S3 J2.S4
  Bottom 0.152: J2.S2 J2.S4 | J2.S3 J2.S1 | J1_INTERNALL.S2 J1_INTERNALL.S4 | J1_INTERNALL.S3 J1_INTERNALL.S1 HMDI-OUT.S2 HMDI-OUT.S4 HMDI-OUT.S3 HMDI-OUT.S1 | J3.S1 J3.S3 | J3.S2 J3.S4
TMDS_CLOCK  (via drill 0.35)
  Top 0.152: J2.11 68.13,33.76 v68.13,31.19 | v78.13,29.19 78.75,28.57 78.75,6.19 77.06,4.49 64.13,4.49 63.44,5.19 57.13,5.19 v56.13,4.19 56.13,4.33 54.91,5.55 54.91,9.87 58.05,13.01 59.38,13.01 59.59,12.8 v60.13,12.8 | v52.13,4.19 51.56,4.19 50.16,5.59 45.96,5.59 44.87,4.49 41.83,4.49 v41.13,5.19 40.74,5.19 40.44,5.49 14.13,5.49 13.47,6.15 J3.11 | J1_INTERNALL.11 66.81,13.09 v66.7,13.2 | HMDI-OUT.11 v40.14,7.2 v40.13,7.19
  Bottom 0.152: v68.13,31.19 68.91,30.41 76.77,30.41 77.99,29.19 v78.13,29.19 | v56.13,4.19 v52.13,4.19 | v66.7,13.2 66.3,12.8 v60.13,12.8 | v40.13,7.19 41.13,6.19 v41.13,5.19
TMDS_DATA_0  (via drill 0.35)
  Top 0.152: J2.8 66.58,31.64 v66.13,31.19 | v77.13,29.19 78.45,27.87 78.45,7.19 76.06,4.8 64.52,4.8 63.74,5.58 57.18,5.58 56.52,5.58 v56.13,5.19 56.13,5.33 55.22,6.24 55.22,9.74 57.88,12.4 v59.13,12.4 | J1_INTERNALL.8 68.19,9.38 68.19,10.65 68.13,10.71 v68.13,12.19 | v52.13,5.19 51.13,5.19 50.42,5.89 45.83,5.89 45.13,5.19 v43.13,5.19 42.13,5.19 41.44,5.88 15.43,5.88 14.97,6.35 J3.8 | HMDI-OUT.8 41.64,7.7 v41.13,7.19
  Bottom 0.152: v77.13,29.19 76.99,29.19 76.08,30.1 67.22,30.1 v66.13,31.19 | v56.13,5.19 v52.13,5.19 | v68.13,12.19 59.34,12.19 v59.13,12.4 | v41.13,7.19 v43.13,5.19
TMDS_DATA_1  (via drill 0.35)
  Top 0.152: J2.5 65.13,33.76 v65.13,31.19 | v76.13,29.19 78.13,27.19 78.13,7.3 76.02,5.19 64.7,5.19 64,5.88 57.31,5.88 57,6.19 v56.13,6.19 56.13,6.33 55.52,6.94 55.52,9.19 v58.13,11.8 | J1_INTERNALL.5 69.81,11.51 v69.13,12.19 | HMDI-OUT.5 v43.14,7.19 | v52.13,6.19 v52.12,6.2 44.53,6.2 | 44.53,6.2 44.13,6.2 44.13,6.19 17.13,6.19 16.47,6.85 J3.5 | v44.13,5.8 44.53,6.2
  Bottom 0.152: v65.13,31.19 66.83,29.5 74.61,29.5 74.91,29.8 75.52,29.8 v76.13,29.19 | v56.13,6.19 v52.13,6.19 | v69.13,12.19 68.44,11.49 59.68,11.49 59.38,11.8 v58.13,11.8 | v43.14,7.19 44.13,6.2 v44.13,5.8
TMDS_DATA_2  (via drill 0.35)
  Top 0.152: J2.2 63.58,31.74 v64.13,31.19 | v75.17,29.19 77.83,26.53 77.83,7.43 75.89,5.49 64.83,5.49 64.13,6.19 57.44,6.19 56.44,7.19 v56.13,7.19 56.13,9.19 58.13,11.19 v59.13,11.19 | J1_INTERNALL.2 71.19,9.38 71.19,10.65 71.13,10.71 v71.13,11.19 | 44.64,6.68 HMDI-OUT.2 | v52.13,7.19 51.62,6.68 51.13,6.68 50.95,6.5 45.3,6.5 45.13,6.68 44.64,6.68 | 44.64,6.68 43.49,6.68 43.39,6.58 18.74,6.58 17.97,7.35 J3.2
  Bottom 0.152: v64.13,31.19 66.13,29.19 v75.17,29.19 | v56.13,7.19 v52.13,7.19 | v71.13,11.19 v59.13,11.19

### Text on the board
tNames: MCP2221A-I/SL